# Altium schematic sheet CONNECTOR_INTERFACE.SchDoc
size A3; SheetNumber: 5; SheetTotal: 23
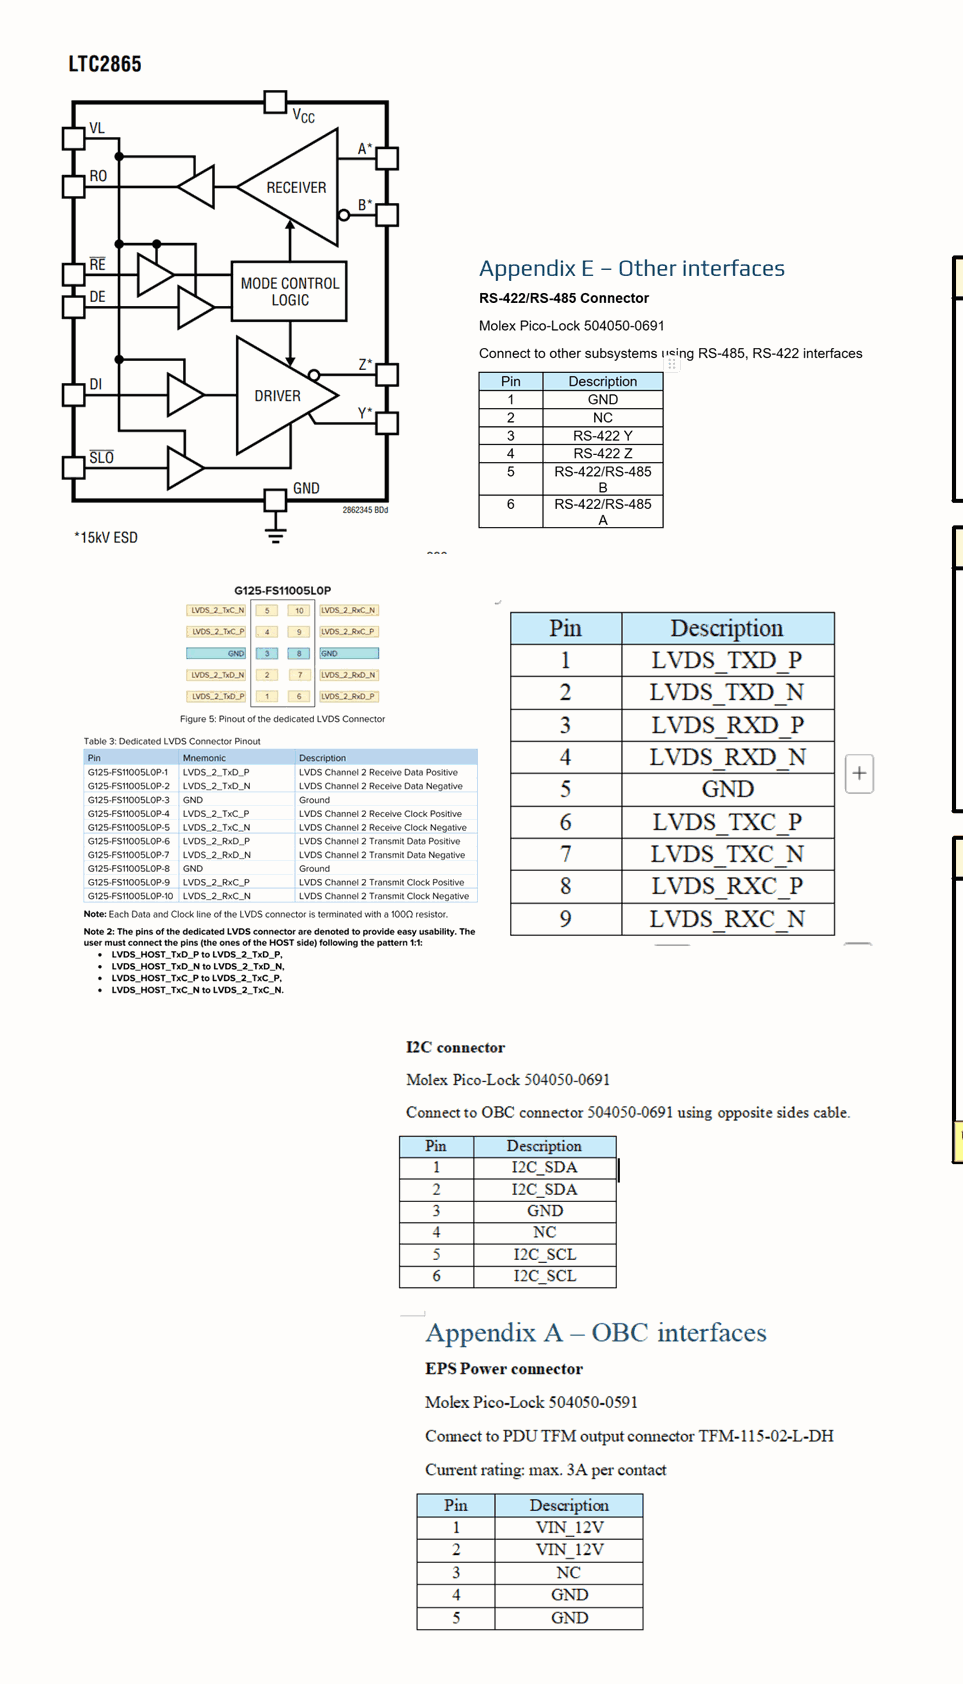
[diagram p0: CONNECTOR_INTERFACE.SchDoc, left]
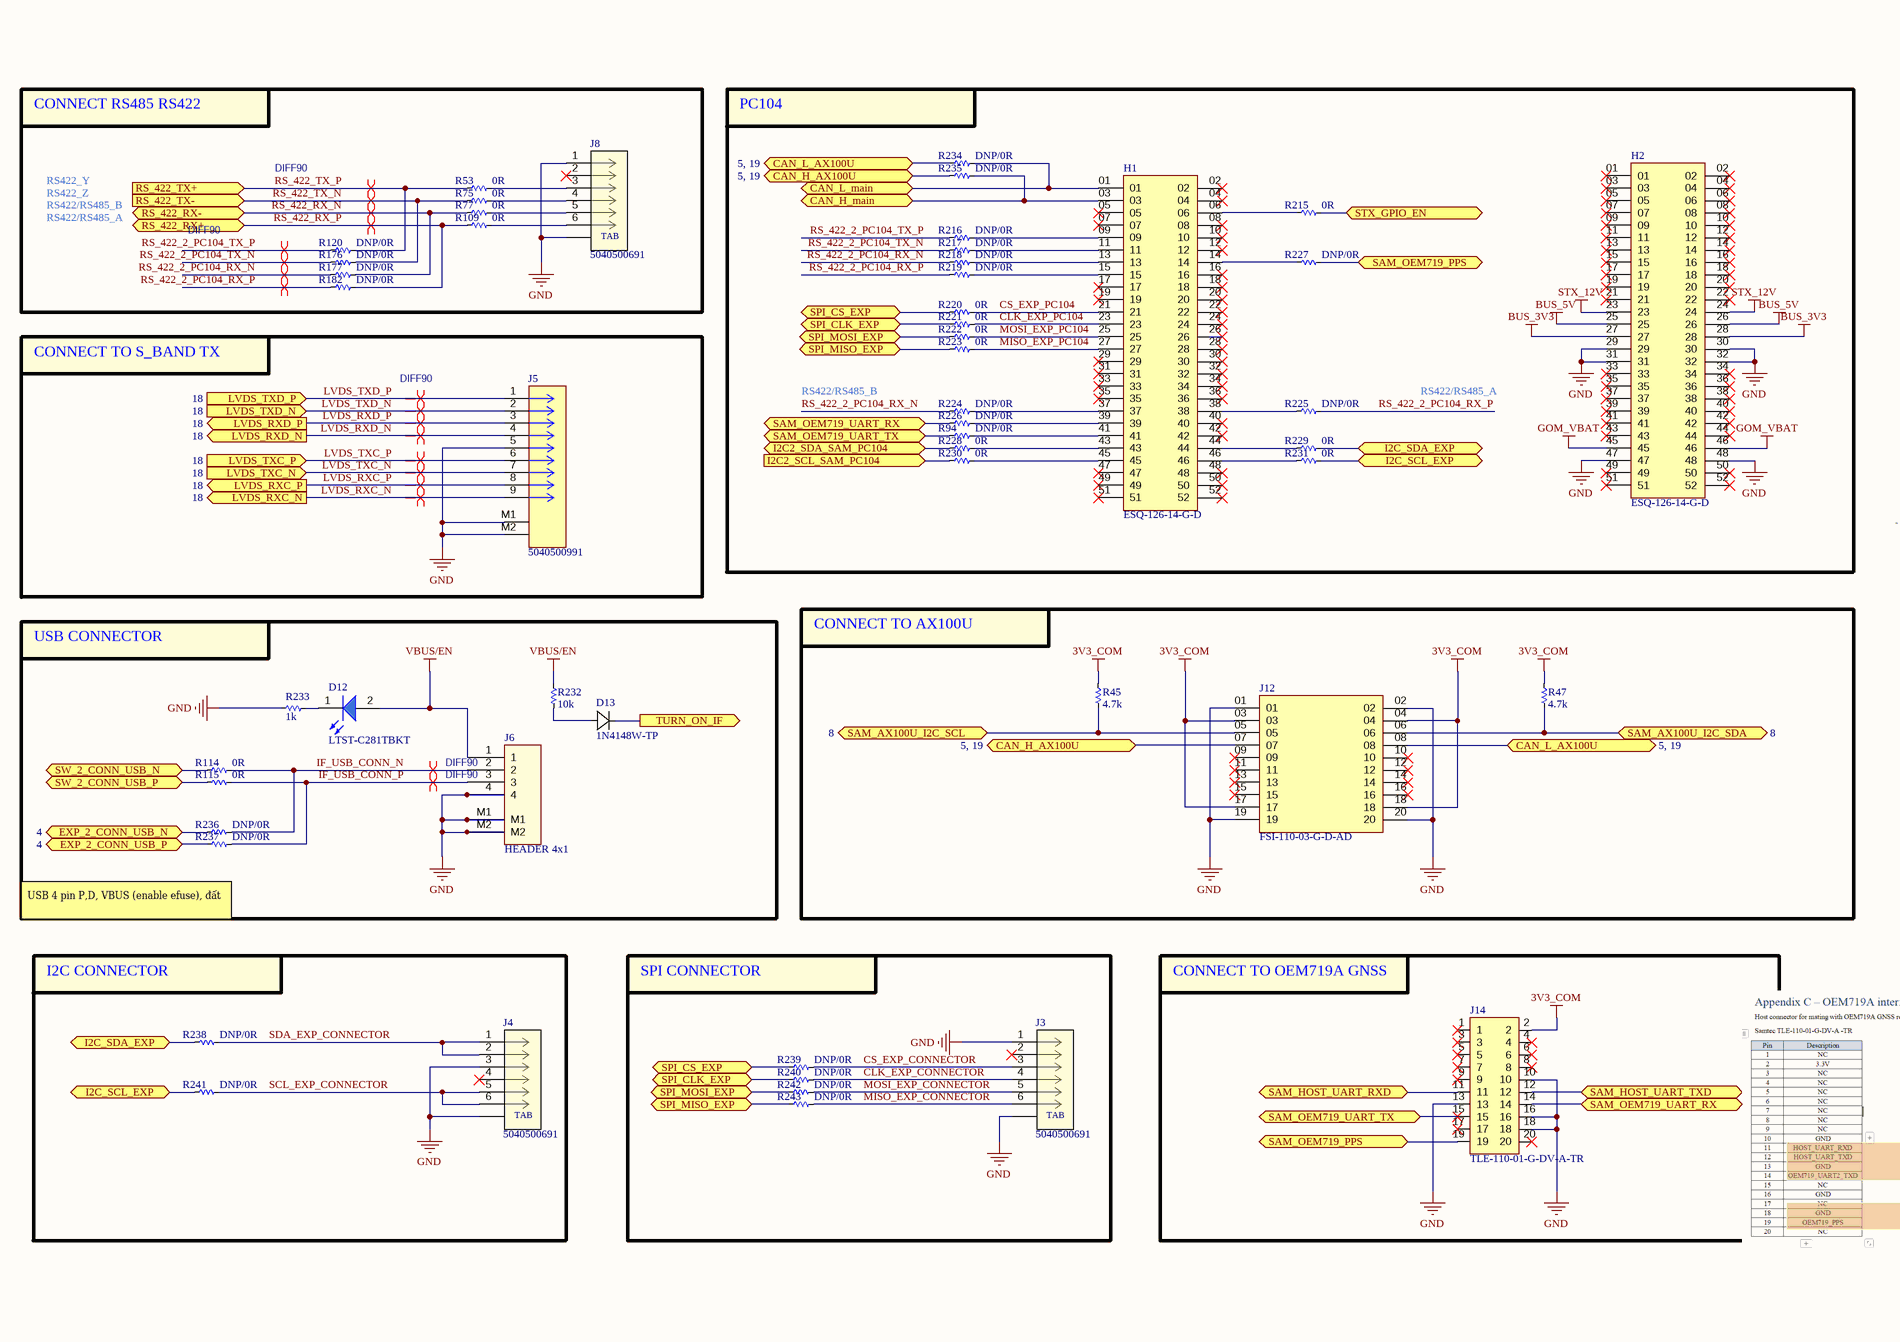
[diagram p1: CONNECTOR_INTERFACE.SchDoc, middle]
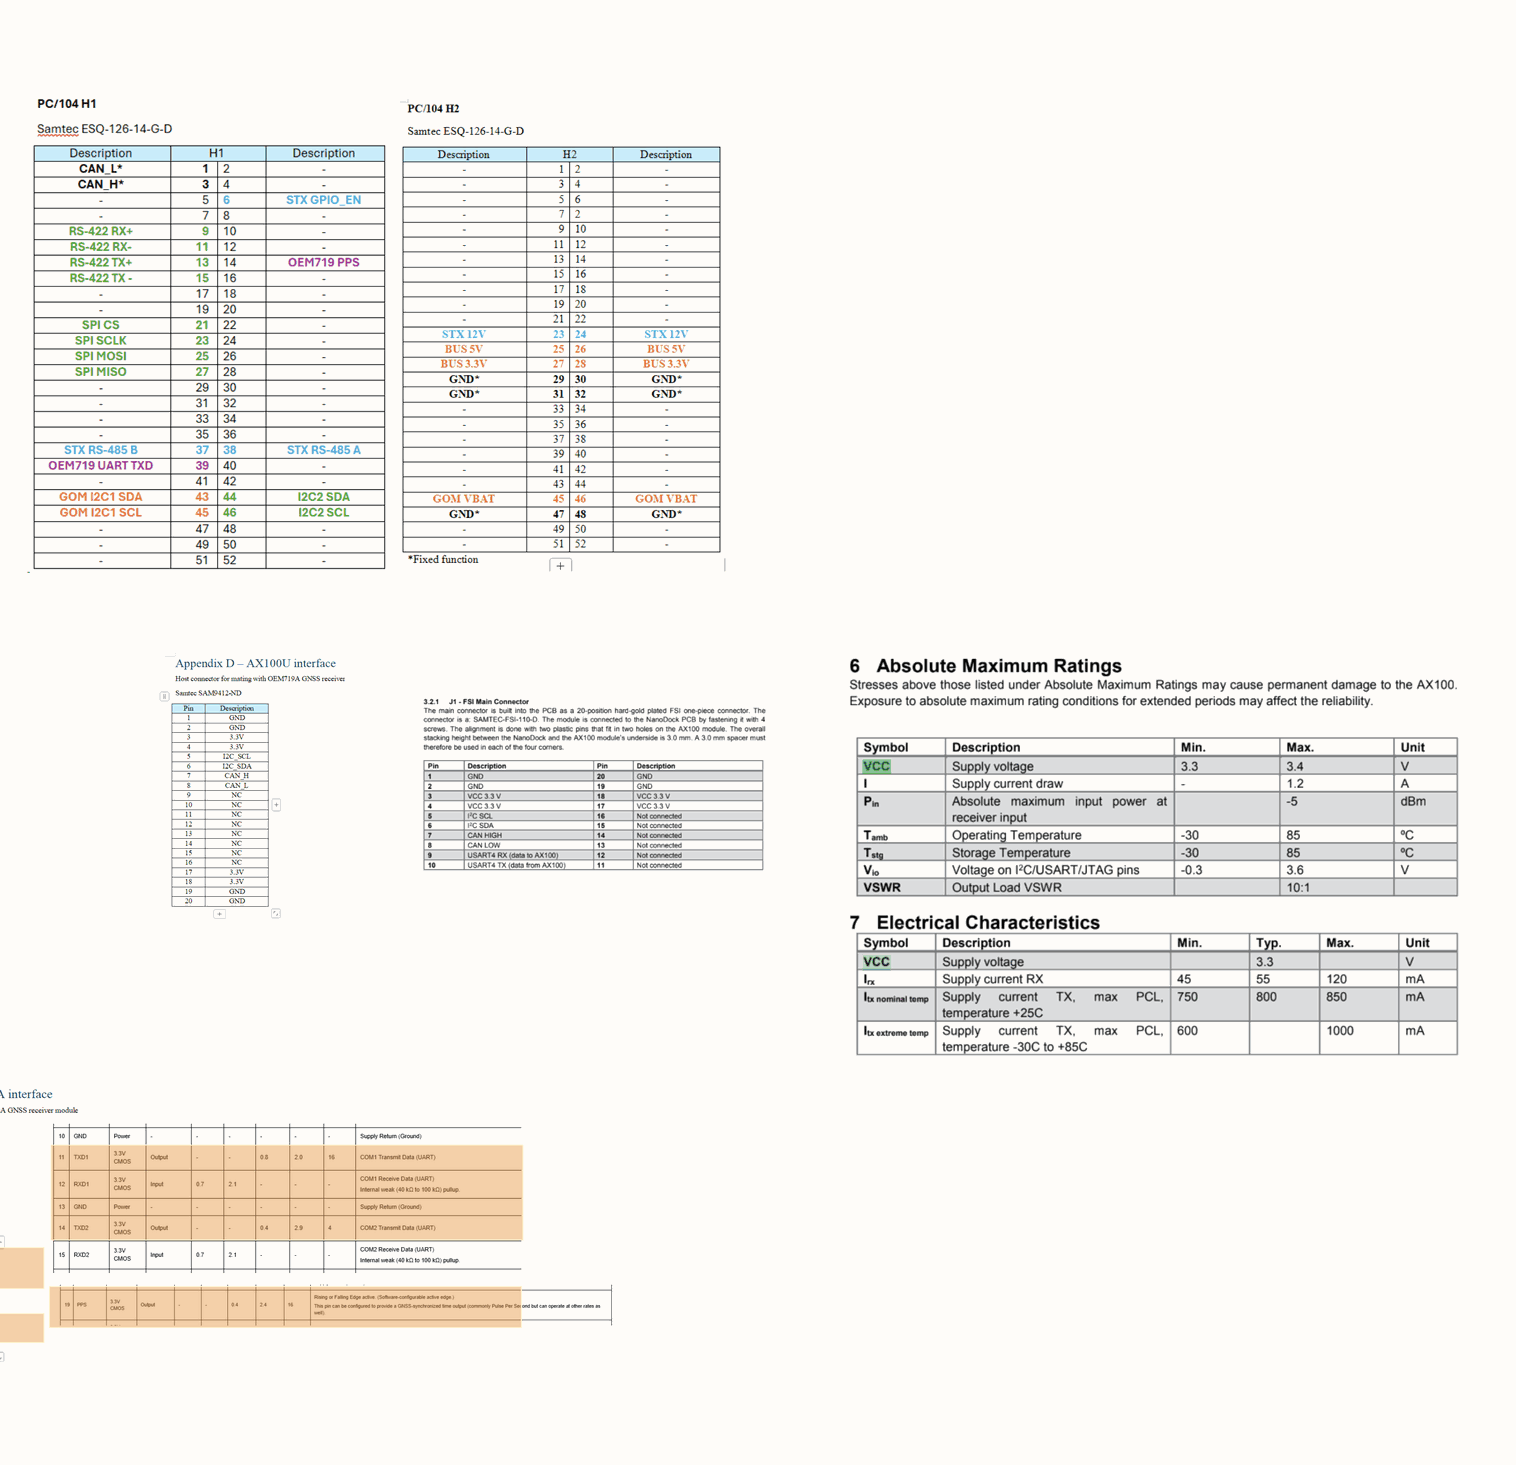
[diagram p2: CONNECTOR_INTERFACE.SchDoc, right]

## Parts
D12  LTST-C281TBKT  [LED_0402]
D13  1N4148W-TP  [SOD123_MCC]
H1  ESQ-126-14-G-D  [SAMTEC_ESQ-126-14-G-D]
H2  ESQ-126-14-G-D  [SAMTEC_ESQ-126-14-G-D]
J3  5040500691  [5040500691]
J4  5040500691  [5040500691]
J5  5040500991  [5040500991]
J6  HEADER 4x1  [MOLEX_5040500491]
J8  5040500691  [5040500691]
J12  FSI-110-03-G-D-AD  [SAMTEC_FSI-110-03-X-D-AD-TR]
J14  TLE-110-01-G-DV-A-TR  [SAMTEC-TLE-110-01-X-DV-A]
R45  4.7k  [RES_C_1005x30_L]
R47  4.7k  [RES_C_1005x30_L]
R53  0R  [RES_C_1005x30_L]
R75  0R  [RES_C_1005x30_L]
R77  0R  [RES_C_1005x30_L]
R94  DNP/0R  [RES_C_1005x30_L]
R109  0R  [RES_C_1005x30_L]
R114  0R  [RES_C_0603X30]
R115  0R  [RES_C_0603X30]
R120  DNP/0R  [RES_C_1005x30_L]
R176  DNP/0R  [RES_C_1005x30_L]
R177  DNP/0R  [RES_C_1005x30_L]
R182  DNP/0R  [RES_C_1005x30_L]
R215  0R  [RES_C_1005x30_L]
R216  DNP/0R  [RES_C_1005x30_L]
R217  DNP/0R  [RES_C_1005x30_L]
R218  DNP/0R  [RES_C_1005x30_L]
R219  DNP/0R  [RES_C_1005x30_L]
R220  0R  [RES_C_1005x30_L]
R221  0R  [RES_C_1005x30_L]
R222  0R  [RES_C_1005x30_L]
R223  0R  [RES_C_1005x30_L]
R224  DNP/0R  [RES_C_1005x30_L]
R225  DNP/0R  [RES_C_1005x30_L]
R226  DNP/0R  [RES_C_1005x30_L]
R227  DNP/0R  [RES_C_1005x30_L]
R228  0R  [RES_C_1005x30_L]
R229  0R  [RES_C_1005x30_L]
R230  0R  [RES_C_1005x30_L]
R231  0R  [RES_C_1005x30_L]
R232  10k  [RES_C_1005x30_L]
R233  1k  [RES_C_1005x30_L]
R234  DNP/0R  [RES_C_1005x30_L]
R235  DNP/0R  [RES_C_1005x30_L]
R236  DNP/0R  [RES_C_0603X30]
R237  DNP/0R  [RES_C_0603X30]
R238  DNP/0R  [RES_C_1005x30_L]
R239  DNP/0R  [RES_C_1005x30_L]
R240  DNP/0R  [RES_C_1005x30_L]
R241  DNP/0R  [RES_C_1005x30_L]
R242  DNP/0R  [RES_C_1005x30_L]
R243  DNP/0R  [RES_C_1005x30_L]

## Blocks framed on the sheet
CONNECT RS485 RS422: J8 R53 R75 R77 R109 R120 R176 R177 R182
PC104: H1 H2 R94 R215-R231 R234 R235
CONNECT TO S_BAND TX: J5
USB CONNECTOR: D12 D13 J6 R114 R115 R232 R233 R236 R237
CONNECT TO AX100U: J12 R45 R47
I2C CONNECTOR: J4 R238 R241
SPI CONNECTOR: J3 R239 R240 R242 R243
CONNECT TO OEM719A GNSS: J14

## Ports
CAN_H_AX100U (bidir, see 5, 19), CAN_H_main (bidir, see 4, 19), CAN_L_AX100U (bidir, see 5, 19), CAN_L_main (bidir, see 4, 19), EXP_2_CONN_USB_N (bidir, see 4), EXP_2_CONN_USB_P (bidir, see 4), I2C2_SCL_SAM_PC104 (in, see 8), I2C2_SDA_SAM_PC104 (bidir, see 8), I2C_SCL_EXP (bidir, see 4, 5, 8), I2C_SDA_EXP (bidir, see 4, 5, 8), LVDS_RXC_N (out, see 18), LVDS_RXC_P (out, see 18), LVDS_RXD_N (out, see 18), LVDS_RXD_P (out, see 18), LVDS_TXC_N (in, see 18), LVDS_TXC_P (in, see 18), LVDS_TXD_N (in, see 18), LVDS_TXD_P (in, see 18), RS_422_RX+ (bidir, see 21), RS_422_RX- (bidir, see 21), RS_422_TX+ (in, see 21), RS_422_TX- (in, see 21), SAM_AX100U_I2C_SCL (bidir, see 8), SAM_AX100U_I2C_SDA (bidir, see 8), SAM_HOST_UART_RXD (bidir, see 8), SAM_HOST_UART_TXD (bidir, see 8), SAM_OEM719_PPS (bidir, see 5, 8), SAM_OEM719_UART_RX (bidir, see 5, 8), SAM_OEM719_UART_TX (bidir, see 5, 8), SPI_CLK_EXP (bidir, see 4, 5), SPI_CS_EXP (bidir, see 4, 5), SPI_MISO_EXP (bidir, see 4, 5), SPI_MOSI_EXP (bidir, see 4, 5), STX_GPIO_EN (bidir, see 8), SW_2_CONN_USB_N (bidir, see 13), SW_2_CONN_USB_P (bidir, see 13), TURN_ON_IF (out, see 3, 4)

## Nets
3V3_COM: J12.03 J12.04 J12.17 J12.18 J14.2 R45.2 R47.2
BUS_3V3: H2.27 H2.28
BUS_5V: H2.25 H2.26
GND: H2.29 H2.30 H2.31 H2.32 H2.47 H2.48 J3.1 J3.7 J4.3 J4.7 J5.5 J5.M1 J5.M2 J6.4 J6.M1 J6.M2 J8.1 J8.7 J12.01 J12.02 J12.19 J12.20 J14.10 J14.13 J14.16 J14.18 R233.1
GOM_VBAT: H2.45 H2.46
STX_12V: H2.23 H2.24
VBUS/EN: D12.2(A) J6.1 R232.1
CAN_H_AX100U: J12.07 R235.1 ; port CAN_H_AX100U
CAN_H_main: H1.03 R235.2 ; port CAN_H_main
CAN_L_AX100U: J12.08 R234.1 ; port CAN_L_AX100U
CAN_L_main: H1.01 R234.2 ; port CAN_L_main
CLK_EXP_CONNECTOR: J3.4 R240.2
CLK_EXP_PC104: H1.23 R221.2
CS_EXP_CONNECTOR: J3.3 R239.2
CS_EXP_PC104: H1.21 R220.2
EXP_2_CONN_USB_N: R236.1 ; port EXP_2_CONN_USB_N
EXP_2_CONN_USB_P: R237.1 ; port EXP_2_CONN_USB_P
I2C2_SCL_SAM_PC104: R230.1 ; port I2C2_SCL_SAM_PC104
I2C2_SDA_SAM_PC104: R228.1 ; port I2C2_SDA_SAM_PC104
I2C_SCL_EXP: R231.2 R241.1 ; port I2C_SCL_EXP
I2C_SDA_EXP: R229.2 R238.1 ; port I2C_SDA_EXP
IF_USB_CONN_N: J6.2 R114.2 R236.2
IF_USB_CONN_P: J6.3 R115.2 R237.2
LVDS_RXC_N: J5.9 ; port LVDS_RXC_N
LVDS_RXC_P: J5.8 ; port LVDS_RXC_P
LVDS_RXD_N: J5.4 ; port LVDS_RXD_N
LVDS_RXD_P: J5.3 ; port LVDS_RXD_P
LVDS_TXC_N: J5.7 ; port LVDS_TXC_N
LVDS_TXC_P: J5.6 ; port LVDS_TXC_P
LVDS_TXD_N: J5.2 ; port LVDS_TXD_N
LVDS_TXD_P: J5.1 ; port LVDS_TXD_P
MISO_EXP_CONNECTOR: J3.6 R243.2
MISO_EXP_PC104: H1.27 R223.2
MOSI_EXP_CONNECTOR: J3.5 R242.2
MOSI_EXP_PC104: H1.25 R222.2
RS_422_2_PC104_RX_N: R177.1 R218.1 R224.1
RS_422_2_PC104_RX_P: R182.1 R219.1 R225.2
RS_422_2_PC104_TX_N: R176.1 R217.1
RS_422_2_PC104_TX_P: R120.1 R216.1
RS_422_RX_N: R77.1 R177.2 ; port RS_422_RX-
RS_422_RX_P: R109.1 R182.2 ; port RS_422_RX+
RS_422_TX_N: R75.1 R176.2 ; port RS_422_TX-
RS_422_TX_P: R53.1 R120.2 ; port RS_422_TX+
SAM_AX100U_I2C_SCL: J12.05 R45.1 ; port SAM_AX100U_I2C_SCL
SAM_AX100U_I2C_SDA: J12.06 R47.1 ; port SAM_AX100U_I2C_SDA
SAM_HOST_UART_RXD: J14.11 ; port SAM_HOST_UART_RXD
SAM_HOST_UART_TXD: J14.12 ; port SAM_HOST_UART_TXD
SAM_OEM719_PPS: J14.19 R227.2 ; port SAM_OEM719_PPS
SAM_OEM719_UART_RX: J14.14 R226.1 ; port SAM_OEM719_UART_RX
SAM_OEM719_UART_TX: J14.15 R94.1 ; port SAM_OEM719_UART_TX
SCL_EXP_CONNECTOR: J4.5 J4.6 R241.2
SDA_EXP_CONNECTOR: J4.1 J4.2 R238.2
SPI_CLK_EXP: R221.1 R240.1 ; port SPI_CLK_EXP
SPI_CS_EXP: R220.1 R239.1 ; port SPI_CS_EXP
SPI_MISO_EXP: R223.1 R243.1 ; port SPI_MISO_EXP
SPI_MOSI_EXP: R222.1 R242.1 ; port SPI_MOSI_EXP
STX_GPIO_EN: R215.2 ; port STX_GPIO_EN
SW_2_CONN_USB_N: R114.1 ; port SW_2_CONN_USB_N
SW_2_CONN_USB_P: R115.1 ; port SW_2_CONN_USB_P
TURN_ON_IF: D13.1 ; port TURN_ON_IF
NetD12_1: D12.1(K) R233.2
NetD13_2: D13.2 R232.2
NetH1_06: H1.06 R215.1
NetH1_09: H1.09 R216.2
NetH1_11: H1.11 R217.2
NetH1_13: H1.13 R218.2
NetH1_14: H1.14 R227.1
NetH1_15: H1.15 R219.2
NetH1_37: H1.37 R224.2
NetH1_38: H1.38 R225.1
NetH1_39: H1.39 R226.2
NetH1_41: H1.41 R94.2
NetH1_43: H1.43 R228.2
NetH1_44: H1.44 R229.1
NetH1_45: H1.45 R230.2
NetH1_46: H1.46 R231.1
NetJ8_3: J8.3 R53.2
NetJ8_4: J8.4 R75.2
NetJ8_5: J8.5 R77.2
NetJ8_6: J8.6 R109.2

Not connected (* = marked no-connect by the designer): H1 02* 04* 05* 07* 08* 10* 12* 16* 17* 18* 19* 20* 22* 24* 26* 28* 29* 30* 31* 32* 33* 34* 35* 36* 40* 42* 47* 48* 49* 50* 51* 52*; H2 01* 02* 03* 04* 05* 06* 07* 08* 09* 10* 11* 12* 13* 14* 15* 16* 17* 18* 19* 20* 21* 22* 33* 34* 35* 36* 37* 38* 39* 40* 41* 42* 43* 44* 49* 50* 51* 52*; J3 2*; J4 4*; J8 2*; J12 09* 10* 11* 12* 13* 14* 15* 16*; J14 1* 3* 4* 5* 6* 7* 8* 9* 17* 20*

## Layout directives
differential pair; differential pair class DIFF90; net class DIFF90; rule Matched Net Lengths [Tolerance = 4mil]: IF_USB_CONN_N, IF_USB_CONN_P, LVDS_RXC_N, LVDS_RXC_P, LVDS_RXD_N, LVDS_RXD_P, LVDS_TXC_N, LVDS_TXC_P, LVDS_TXD_N, LVDS_TXD_P, RS_422_2_PC104_RX_N, RS_422_2_PC104_RX_P, RS_422_2_PC104_TX_N, RS_422_2_PC104_TX_P, RS_422_RX_N, RS_422_RX_P, RS_422_TX_N, RS_422_TX_P

## Notes on the sheet
- RS422_Z
- RS422_Y
- RS422/RS485_A
- RS422/RS485_B
- USB 4 pin P,D, VBUS (enable efuse), đất
- Project:
- Page Contents:
- Revision:
- Design:
- Date:
- Size:
- A3
- Document Number:
- Sheet:
- of
- (in symbol 5040500691) TAB

## Library data of the parts
D12 = LED_BLUE
D13 = 1N4148W-TP: Description; Manufacturer_Name: MCC; Copyright: Copyright (C) 2026 Ultra Librarian. All rights reserved.; Manufacturer_Part_Number: 1N4148W-TP
H1 H2 = ESQ-126-14-G-D: CONN SOCKET 52POS 0.1 GOLD PCB; MF: Samtec; MP: ESQ-126-14-G-D; Price: None; Package: None; Value: *; Availability: Unavailable
J3 J4 J8 = 5040500691: 1.50mm Pitch, Pico-Lock PCB Header, Single Row, Right-Angle, Surface Mount, Gold (Au) Plating, Positive Lock, 6 Circuits, Tape and Reel; Manufacturer_Name: Molex Connector Corporation; Copyright: Copyright (C) 2025 Ultra Librarian. All rights reserved.; Manufacturer_Part_Number: 5040500691; Datasheet: https://www.molex.com/en-us/products/part-detail-pdf/5040500691?display=pdf; RefDes: RefDes; Type: Type
J5 = 5040500991: Connector Header Surface Mount, Right Angle 9 position 0.059" (1.50mm)
J6 = Header 4x1_2M
J12 = FSI-110-03-X-D-AD-TR: CONN STACKING 20POS SMD GOLD; Price: None; Value: *; Package: None; MP: FSI-110-03-X-D-AD-TR; Availability: Unavailable
J14 = SAMTEC-TLE-110-01-X-DV-A: CONN RCPT 20POS 0.079 GOLD SMD; Availability: Unavailable; MP: SAMTEC-TLE-110-01-X-DV-A; Price: None; Value: *; Package: None
R45 R47 R53 R75 R77 R94 R109 R114 R115 R120 R176 R177 R182 R215-R243 = _RES_B_2: RES